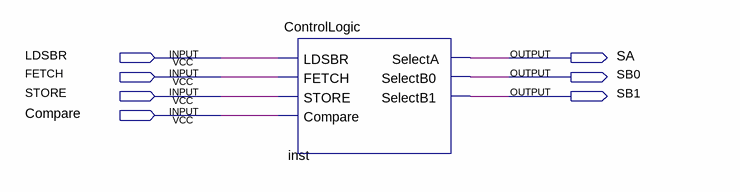
[diagram p0: schematic sheet]
// Quartus schematic tesr_main.bdf as structural Verilog: 1 symbols, 7 pins
module tesr_main (
  input  LDSBR,
  input  FETCH,
  input  STORE,
  input  Compare,
  output SA,
  output SB0,
  output SB1
);

  ControlLogic inst (
    .LDSBR(LDSBR), .FETCH(FETCH), .STORE(STORE), .Compare(Compare), .SelectA(SA), .SelectB0(SB0),
    .SelectB1(SB1));
endmodule
